# Altium schematic sheet 1-FOB.SchDoc
size A4
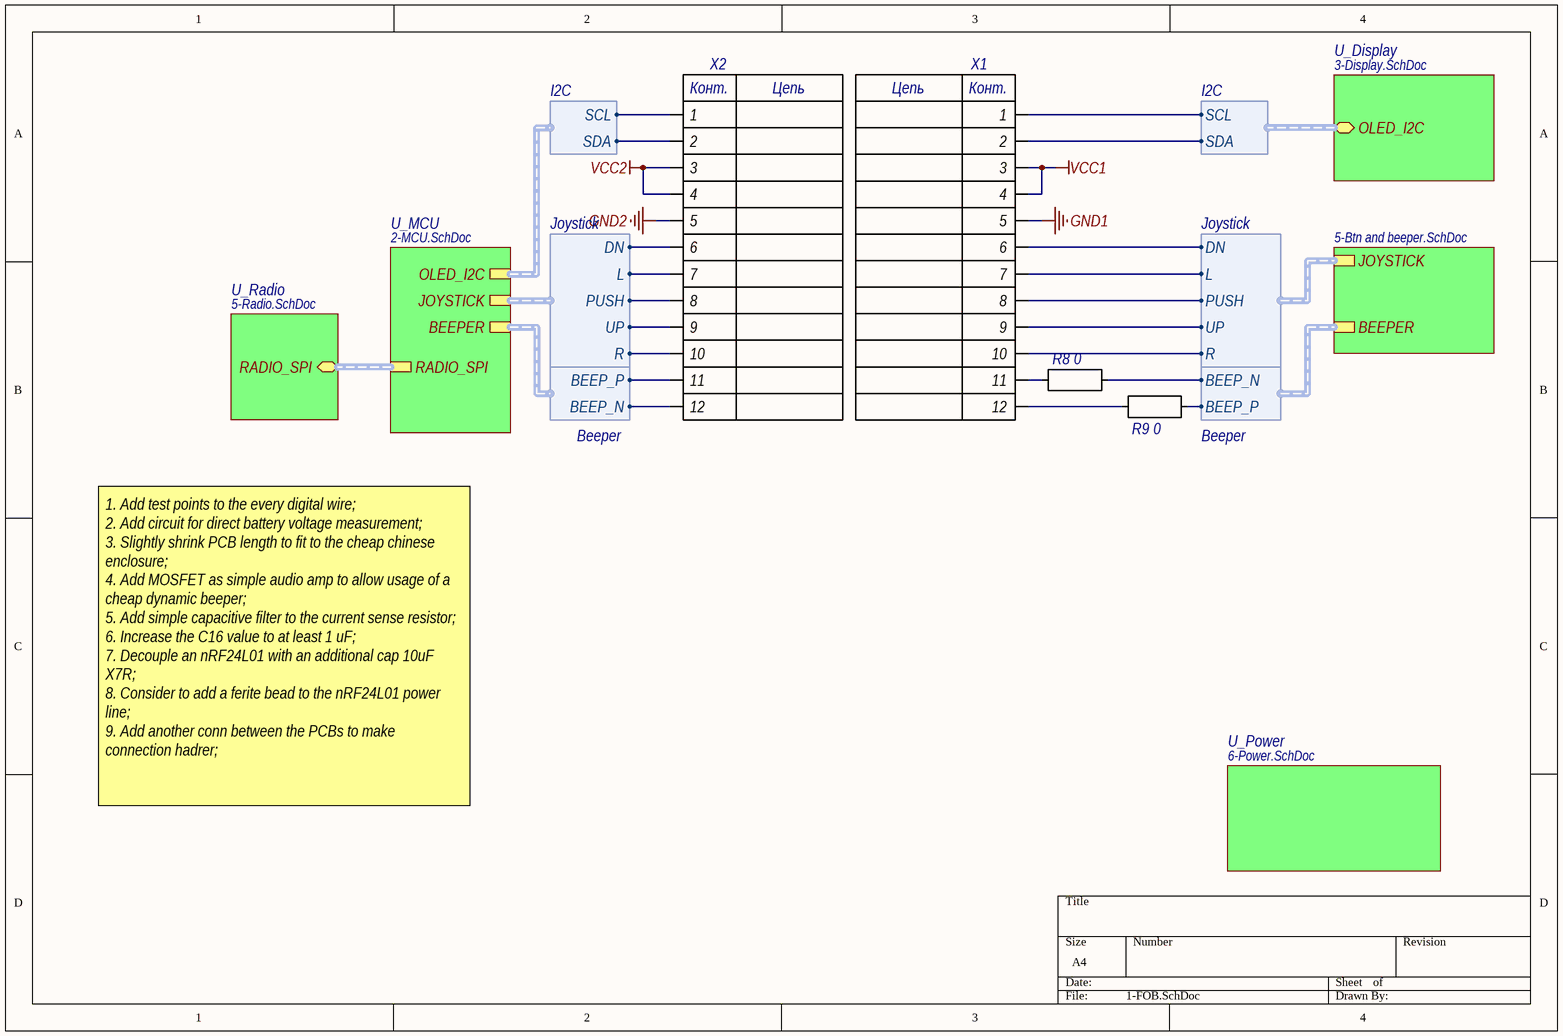
[diagram p0: 1-FOB.SchDoc]

## Parts
R8  value 0  [CHIP_0402_R]  (hidden comment: Резистор)
R9  value 0  [CHIP_0402_R]  (hidden comment: Резистор)
X1  PLD-12  [PLD1.27-12 SMD]  (value not drawn)
X2  PBD-12  [PBD1.27-12 SMD]  (value not drawn)

## Sub-sheets
U_Btn and beeper = 5-Btn and beeper.SchDoc: JOYSTICK (harness Joystick), BEEPER (harness Beeper)
U_Display = 3-Display.SchDoc: OLED_I2C (harness I2C)
U_MCU = 2-MCU.SchDoc: JOYSTICK (harness Joystick), BEEPER (harness Beeper), OLED_I2C (harness I2C), RADIO_SPI (harness RADIO_SPI)
U_Power = 6-Power.SchDoc: no entries
U_Radio = 5-Radio.SchDoc: RADIO_SPI (harness RADIO_SPI)

## Harnesses
Joystick: UP, DN, L, R, PUSH
Beeper: BEEP_P, BEEP_N
I2C: SCL, SDA
Joystick: DN, L, PUSH, R, UP

## Nets
GND1: X1.5
GND2: X2.5
VCC1: X1.3 X1.4
VCC2: X2.3 X2.4
NetR8_1: R8.1 X1.11
NetR8_2: R8.2 ; sheet U_Btn and beeper/BEEPER.BEEP_N
NetR9_1: R9.1 X1.12
NetR9_2: R9.2 ; sheet U_Btn and beeper/BEEPER.BEEP_P
NetX1_1: X1.1 ; sheet U_Display/OLED_I2C.SCL
NetX1_2: X1.2 ; sheet U_Display/OLED_I2C.SDA
NetX1_6: X1.6 ; sheet U_Btn and beeper/JOYSTICK.DN
NetX1_7: X1.7 ; sheet U_Btn and beeper/JOYSTICK.L
NetX1_8: X1.8 ; sheet U_Btn and beeper/JOYSTICK.PUSH
NetX1_9: X1.9 ; sheet U_Btn and beeper/JOYSTICK.UP
NetX1_10: X1.10 ; sheet U_Btn and beeper/JOYSTICK.R
NetX2_1: X2.1 ; sheet U_MCU/OLED_I2C.SCL
NetX2_2: X2.2 ; sheet U_MCU/OLED_I2C.SDA
NetX2_6: X2.6 ; sheet U_MCU/JOYSTICK.DN
NetX2_7: X2.7 ; sheet U_MCU/JOYSTICK.L
NetX2_8: X2.8 ; sheet U_MCU/JOYSTICK.PUSH
NetX2_9: X2.9 ; sheet U_MCU/JOYSTICK.UP
NetX2_10: X2.10 ; sheet U_MCU/JOYSTICK.R
NetX2_11: X2.11 ; sheet U_MCU/BEEPER.BEEP_P
NetX2_12: X2.12 ; sheet U_MCU/BEEPER.BEEP_N

## Buses and harness runs
harness sheet U_MCU/RADIO_SPI = sheet U_Radio/RADIO_SPI

## Notes on the sheet
- 1. Add test points to the every digital wire;
  2. Add circuit for direct battery voltage measurement;
  3. Slightly shrink PCB length to fit to the cheap chinese enclosure;
  4. Add MOSFET as simple audio amp to allow usage of a cheap dynamic beeper;
  5. Add simple capacitive filter to the current sense resistor;
  6. Increase the C16 value to at least 1 uF;
  7. Decouple an nRF24L01 with an additional cap 10uF X7R;
  8. Consider to add a ferite bead to the nRF24L01 power line;
  9. Add another conn between the PCBs to make connection hadrer;
- (in symbol PBD-12) Конт.; Цепь
- (in symbol PLD-12) Цепь; Конт.

## Library data of the parts
R8 R9 = Резистор: PartNumber: RC0402JR-070RL; Mfg: YAGEO
X1 = PLD-12: PartNumber: PLLD1.27-80 (2X40) SMD
X2 = PBD-12: PartNumber: PBD1.27-12 (2X06) SMD